# EAGLE design Scheda_motori_L298 (EAGLE 6.5.0)
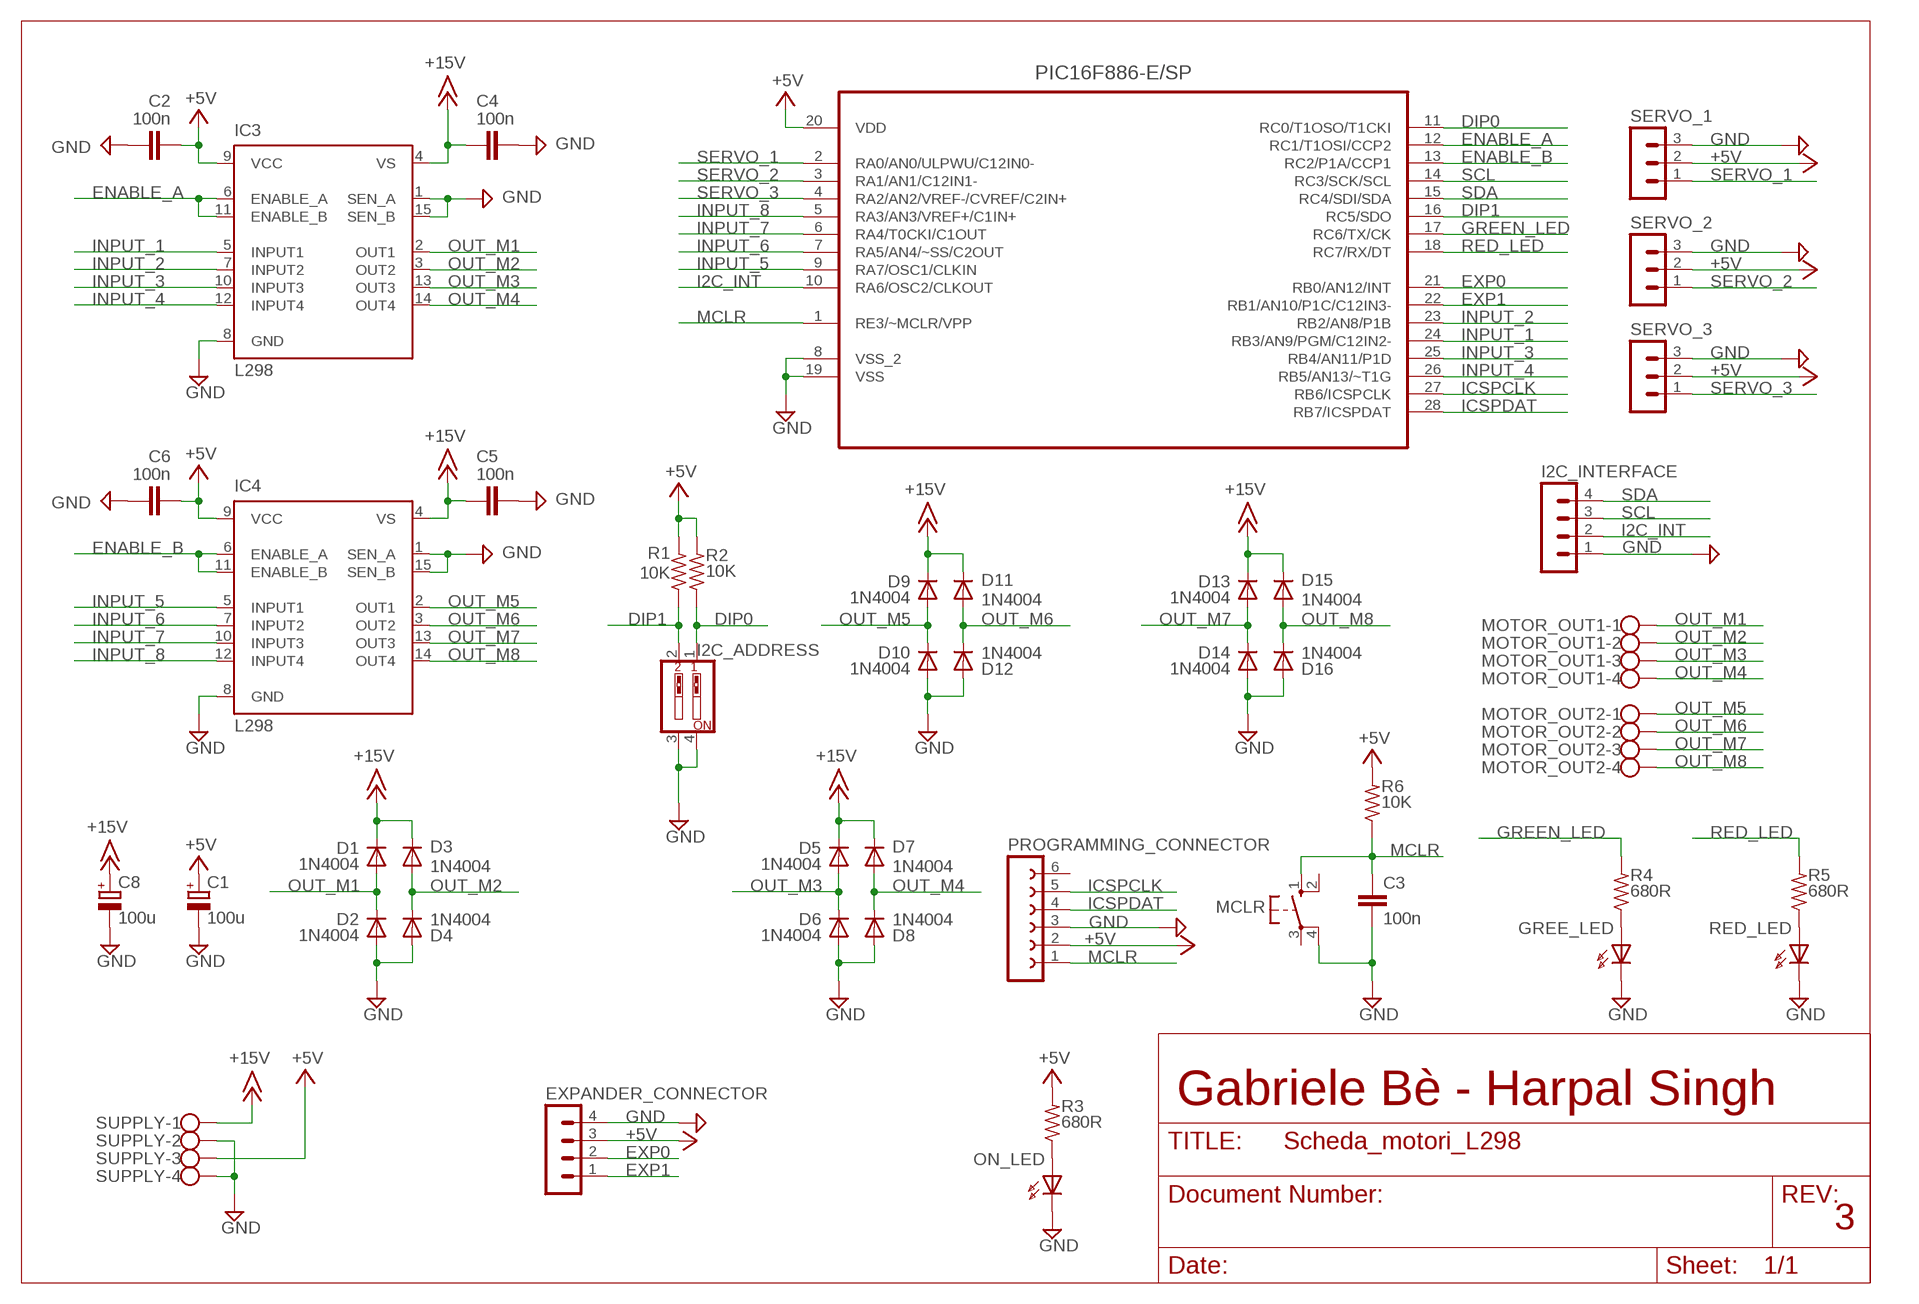
[diagram p0: schematic, sheet 1]

## Parts
C1  100u  CPOL-EUE2.5-7  [E2,5-7]
C2  100n  C-EU050-024X044  [C050-024X044]
C3  100n  C-EU050-024X044  [C050-024X044]
C4  100n  C-EU050-024X044  [C050-024X044]
C5  100n  C-EU050-024X044  [C050-024X044]
C6  100n  C-EU050-024X044  [C050-024X044]
C8  100u  CPOL-EUE2.5-7  [E2,5-7]
D1  1N4004  [DO41-10]
D2  1N4004  [DO41-10]
D3  1N4004  [DO41-10]
D4  1N4004  [DO41-10]
D5  1N4004  [DO41-10]
D6  1N4004  [DO41-10]
D7  1N4004  [DO41-10]
D8  1N4004  [DO41-10]
D9  1N4004  [DO41-10]
D10  1N4004  [DO41-10]
D11  1N4004  [DO41-10]
D12  1N4004  [DO41-10]
D13  1N4004  [DO41-10]
D14  1N4004  [DO41-10]
D15  1N4004  [DO41-10]
D16  1N4004  [DO41-10]
EXPANDER_CONNECTOR  MA04-1  [MA04-1]
GREE_LED  HLMP6  [HLMP6]
I2C_ADDRESS  SW_DIP-2  [EDG-02]
I2C_INTERFACE  MA04-1  [MA04-1]
IC3  L298  [MULTIWATT-15]
IC4  L298  [MULTIWATT-15]
MCLR  10-XX  [B3F-10XX]
MOTOR_OUT1  W237-4  [W237-4]
MOTOR_OUT2  W237-4  [W237-4]
ON_LED  HLMP6  [HLMP6]
PROGRAMMING_CONNECTOR  FE06-1  [FE06]
R1  10K  R-US_0207/10  [0207/10]
R2  10K  R-US_0207/10  [0207/10]
R3  680R  R-US_0207/10  [0207/10]
R4  680R  R-US_0207/10  [0207/10]
R5  680R  R-US_0207/10  [0207/10]
R6  10K  R-US_0207/10  [0207/10]
RED_LED  HLMP6  [HLMP6]
SERVO_1  MA03-1  [MA03-1]
SERVO_2  MA03-1  [MA03-1]
SERVO_3  MA03-1  [MA03-1]
SUPPLY  W237-4  [W237-4]
U$1  PIC16F886-E/SP  [DIP254P762X508-28]

## Nets
+5V: C1.+ C2.2 C6.2 EXPANDER_CONNECTOR.3 IC3.9(VCC) IC4.9(VCC) PROGRAMMING_CONNECTOR.2 R1.2 R2.2 R3.2 R6.2 SERVO_1.2 SERVO_2.2 SERVO_3.2 SUPPLY.3 U$1.20(VDD)
+15V: C4.1 C5.1 C8.+ D1.C D3.C D5.C D7.C D9.C D11.C D13.C D15.C IC3.4(VS) IC4.4(VS) SUPPLY.1
DIP0: I2C_ADDRESS.1 R2.1 U$1.11(RC0/T1OSO/T1CKI)
DIP1: I2C_ADDRESS.2 R1.1 U$1.16(RC5/SDO)
ENABLE_A: IC3.6(ENABLE_A) IC3.11(ENABLE_B) U$1.12(RC1/T1OSI/CCP2)
ENABLE_B: IC4.6(ENABLE_A) IC4.11(ENABLE_B) U$1.13(RC2/P1A/CCP1)
EXP0: EXPANDER_CONNECTOR.2 U$1.21(RB0/AN12/INT)
EXP1: EXPANDER_CONNECTOR.1 U$1.22(RB1/AN10/P1C/C12IN3-)
GND: C1.- C2.1 C3.2 C4.2 C5.2 C6.1 C8.- D2.A D4.A D6.A D8.A D10.A D12.A D14.A D16.A EXPANDER_CONNECTOR.4 GREE_LED.K I2C_ADDRESS.3 I2C_ADDRESS.4 I2C_INTERFACE.1 IC3.1(SEN_A) IC3.8(GND) IC3.15(SEN_B) IC4.1(SEN_A) IC4.8(GND) IC4.15(SEN_B) MCLR.4(P1) ON_LED.K PROGRAMMING_CONNECTOR.3 RED_LED.K SERVO_1.3 SERVO_2.3 SERVO_3.3 SUPPLY.2 SUPPLY.4 U$1.8(VSS_2) U$1.19(VSS)
GREEN_LED: R4.2 U$1.17(RC6/TX/CK)
I2C_INT: I2C_INTERFACE.2 U$1.10(RA6/OSC2/CLKOUT)
ICSPCLK: PROGRAMMING_CONNECTOR.5 U$1.27(RB6/ICSPCLK)
ICSPDAT: PROGRAMMING_CONNECTOR.4 U$1.28(RB7/ICSPDAT)
INPUT_1: IC3.5(INPUT1) U$1.24(RB3/AN9/PGM/C12IN2-)
INPUT_2: IC3.7(INPUT2) U$1.23(RB2/AN8/P1B)
INPUT_3: IC3.10(INPUT3) U$1.25(RB4/AN11/P1D)
INPUT_4: IC3.12(INPUT4) U$1.26(RB5/AN13/~T1G)
INPUT_5: IC4.5(INPUT1) U$1.9(RA7/OSC1/CLKIN)
INPUT_6: IC4.7(INPUT2) U$1.7(RA5/AN4/~SS/C2OUT)
INPUT_7: IC4.10(INPUT3) U$1.6(RA4/T0CKI/C1OUT)
INPUT_8: IC4.12(INPUT4) U$1.5(RA3/AN3/VREF+/C1IN+)
MCLR: C3.1 MCLR.1(S) PROGRAMMING_CONNECTOR.1 R6.1 U$1.1(RE3/~MCLR/VPP)
N$3: ON_LED.A R3.1
N$4: GREE_LED.A R4.1
N$5: R5.1 RED_LED.A
OUT_M1: D1.A D2.C IC3.2(OUT1) MOTOR_OUT1.1
OUT_M2: D3.A D4.C IC3.3(OUT2) MOTOR_OUT1.2
OUT_M3: D5.A D6.C IC3.13(OUT3) MOTOR_OUT1.3
OUT_M4: D7.A D8.C IC3.14(OUT4) MOTOR_OUT1.4
OUT_M5: D9.A D10.C IC4.2(OUT1) MOTOR_OUT2.1
OUT_M6: D11.A D12.C IC4.3(OUT2) MOTOR_OUT2.2
OUT_M7: D13.A D14.C IC4.13(OUT3) MOTOR_OUT2.3
OUT_M8: D15.A D16.C IC4.14(OUT4) MOTOR_OUT2.4
RED_LED: R5.2 U$1.18(RC7/RX/DT)
SCL: I2C_INTERFACE.3 U$1.14(RC3/SCK/SCL)
SDA: I2C_INTERFACE.4 U$1.15(RC4/SDI/SDA)
SERVO_1: SERVO_1.1 U$1.2(RA0/AN0/ULPWU/C12IN0-)
SERVO_2: SERVO_2.1 U$1.3(RA1/AN1/C12IN1-)
SERVO_3: SERVO_3.1 U$1.4(RA2/AN2/VREF-/CVREF/C2IN+)
Unconnected: MCLR.2(S1) MCLR.3(P) PROGRAMMING_CONNECTOR.6

## Notes on the sheet
- Gabriele Bè - Harpal Singh
- 3

## Library data of the parts
C1 C8 = ITIS:CPOL-EU: POLARIZED CAPACITOR, European symbol
C2-C6 = rcl:C-EU: CAPACITOR, European symbol
D1-D16 = ITIS:1N4004: DIODE general purpose rectifier, 1 A
EXPANDER_CONNECTOR I2C_INTERFACE = con-lstb:MA04-1: PIN HEADER; OC_FARNELL: unknown; OC_NEWARK: unknown
GREE_LED ON_LED RED_LED = display-hp:HLMP6: LED 2mm horizontal; MF: AGILENT TECHNOLOGIES; MPN: HLMP-6500; OC_FARNELL: 1652490; OC_NEWARK: 40K0088
I2C_ADDRESS = special:SW_DIP-2: DIP SWITCH
IC3 IC4 = st-microelectronics:L298: DUAL FULL-BRIDGE DRIVER
MCLR = ITIS:10-XX: OMRON SWITCH
MOTOR_OUT1 MOTOR_OUT2 SUPPLY = con-wago-500:W237-4: WAGO SCREW CLAMP; OC_FARNELL: unknown; OC_NEWARK: unknown
PROGRAMMING_CONNECTOR = con-lsta:FE06-1: FEMALE HEADER; OC_FARNELL: unknown; OC_NEWARK: unknown
R1-R6 = resistor:R-US_: RESISTOR, American symbol
SERVO_1-SERVO_3 = con-lstb:MA03-1: PIN HEADER; OC_FARNELL: unknown; OC_NEWARK: unknown
U$1 = Microchip_By_element14_Batch_1:PIC16F886-E/SP: 8-Bit CMOS Microcontrollers; MPN: PIC16F886-E/SP; OC_FARNELL: 1579590; OC_NEWARK: 74K8573; PACKAGE: DIP-28; SUPPLIER: Microchip

## Board
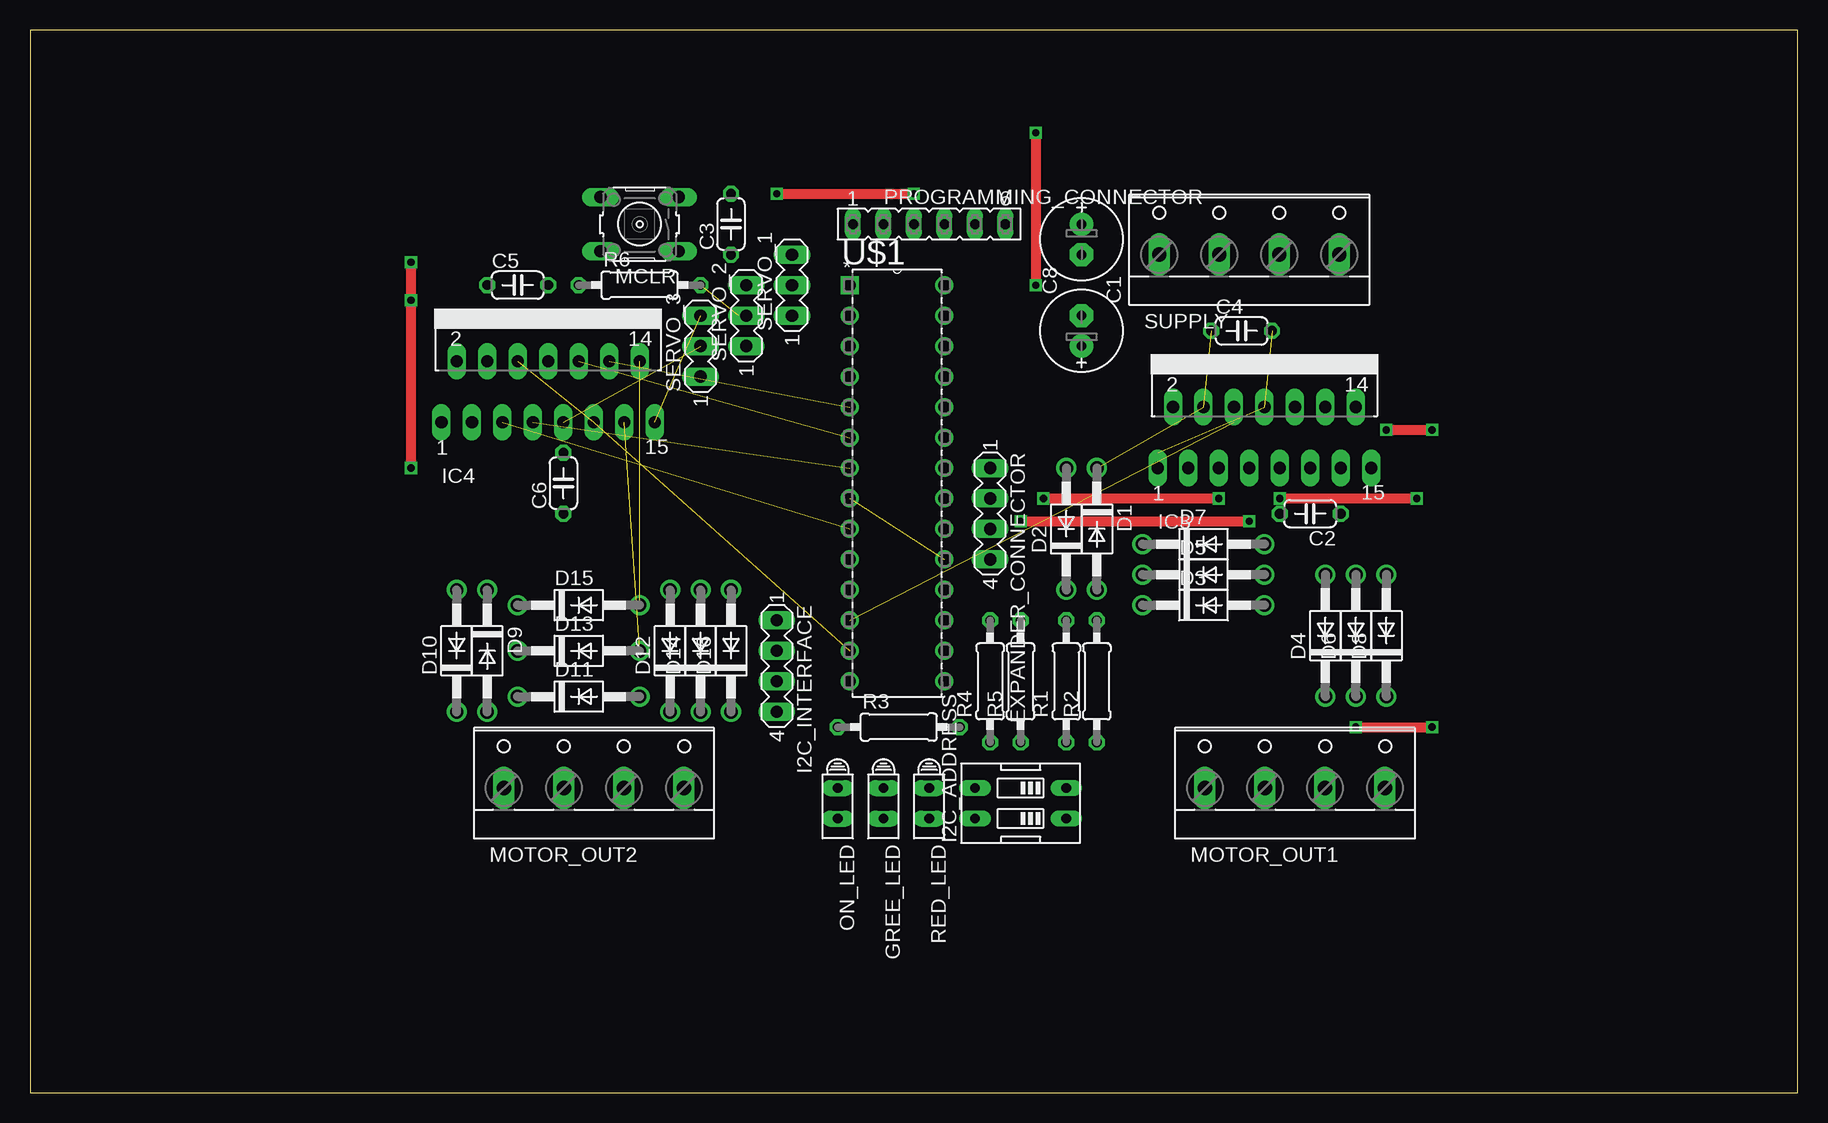
[diagram p1: board, top side]
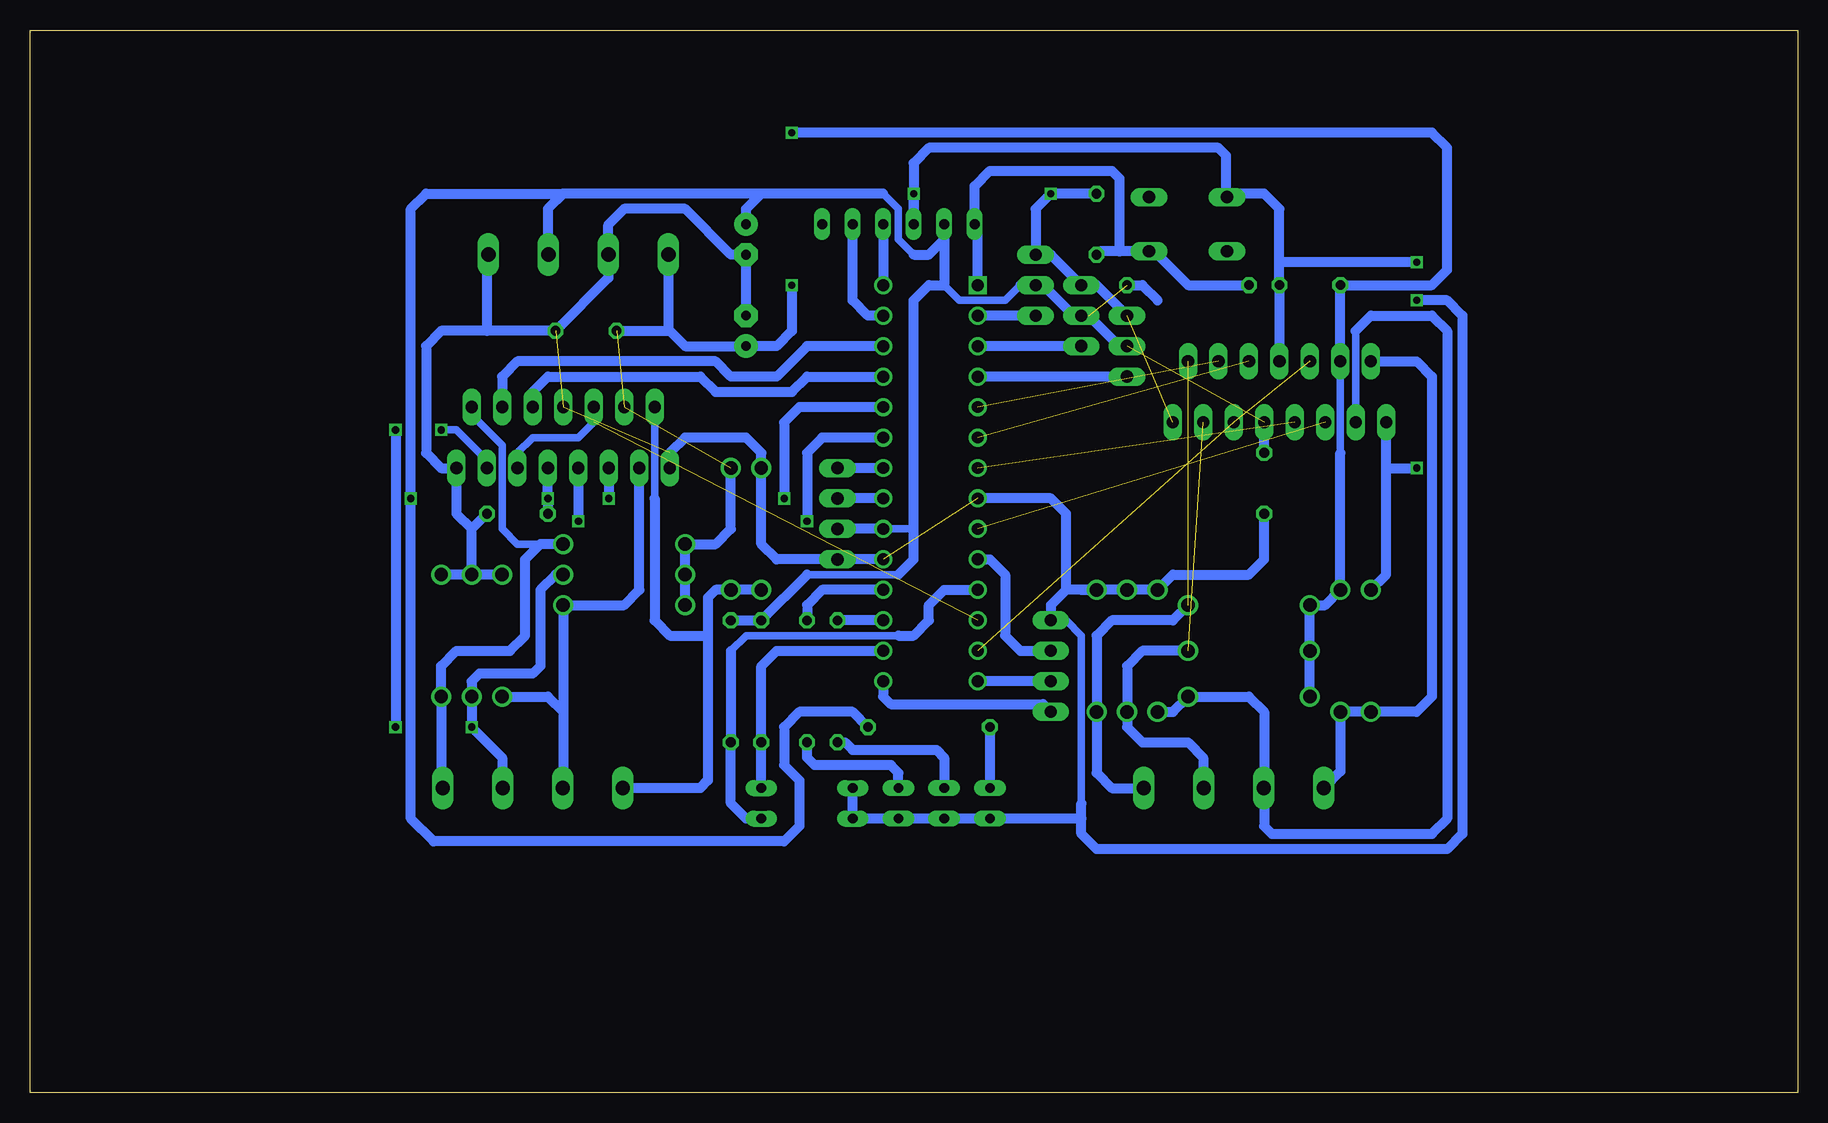
[diagram p2: board, bottom side, seen from below]

Size 147.3 x 88.57 mm. Coordinates in mm from the lower left corner, seen from the top.
Outline: 0,0 147.3,0 147.3,88.57 0,88.57 0,0
Copper layers (1*16): Top 0.035mm / dielectric 1.5mm / Bottom 0.035mm
Design rules "default": minimum track width 10mil, minimum drill 24mil, track to track 8mil, track to pad 8mil, pad to pad 8mil, via to via 8mil, smd to smd 8mil, copper to edge 40mil, drill to drill 8mil, minimum pad ring 10mil, minimum via ring 8mil, stop-mask expansion 4mil, vias tented up to drill 0mil, thermal gap 10mil

### Footprints (pad centres in the part's own frame; a part is rotated, then mirrored left to right if it is on the bottom)
E2,5-7 = drill 0.813 pad 1.93: + -1.27,0 | drill 0.813 pad 1.93 octagon: - 1.27,0
C050-024X044 = drill 0.813 octagon: 1 -2.54,0; 2 2.54,0
DO41-10 = drill 1.118: A 5.08,0; C -5.08,0
MA04-1 = drill 1.016 long: 1 -3.81,0; 2 -1.27,0; 3 1.27,0; 4 3.81,0
HLMP6 = drill 0.813 long: A -1.27,0; K 1.27,0
EDG-02 = drill 0.813 long: 1 -1.27,-3.81; 2 1.27,-3.81; 3 1.27,3.81; 4 -1.27,3.81
MULTIWATT-15 = drill 1.016 long: 1 -8.89,-7.62; 2 -7.62,-2.54; 3 -6.35,-7.62; 4 -5.08,-2.54; 5 -3.81,-7.62; 6 -2.54,-2.54; 7 -1.27,-7.62; 8 0,-2.54; 9 1.27,-7.62; 10 2.54,-2.54; 11 3.81,-7.62; 12 5.08,-2.54; 13 6.35,-7.62; 14 7.62,-2.54; 15 8.89,-7.62
B3F-10XX = drill 1.016 long: 1 -3.251,2.261; 2 3.251,2.261; 3 -3.251,-2.261; 4 3.251,-2.261
W237-4 = drill 1.194 long: 1 -7.5,-1.27; 2 -2.5,-1.27; 3 2.5,-1.27; 4 7.5,-1.27
FE06 = drill 0.813 long: 1 -6.35,0; 2 -3.81,0; 3 -1.27,0; 4 1.27,0; 5 3.81,0; 6 6.35,0
0207/10 = drill 0.813 octagon: 1 -5.08,0; 2 5.08,0
MA03-1 = drill 1.016 long: 1 -2.54,0; 2 0,0; 3 2.54,0
DIP254P762X508-28 = drill 0.991 square: 1 -7.874,33.02 | drill 0.991: 2 -7.874,30.48; 3 -7.874,27.94; 4 -7.874,25.4; 5 -7.874,22.86; 6 -7.874,20.32; 7 -7.874,17.78; 8 -7.874,15.24; 9 -7.874,12.7; 10 -7.874,10.16; 11 -7.874,7.62; 12 -7.874,5.08; 13 -7.874,2.54; 14 -7.874,0; 15 0,0; 16 0,2.54; 17 0,5.08; 18 0,7.62; 19 0,10.16; 20 0,12.7; 21 0,15.24; 22 0,17.78; 23 0,20.32; 24 0,22.86; 25 0,25.4; 26 0,27.94; 27 0,30.48; 28 0,33.02

### Placement (x,y rotation side)
C1  87.63,71.12 270 top
C2  106.68,48.26 180 top
C3  58.42,72.39 90 top
C4  100.97,63.5 0 top
C5  40.64,67.31 0 top
C6  44.45,50.8 90 top
C8  87.63,63.5 90 top
D1  88.9,46.99 270 top
D2  86.36,46.99 90 top
D3  97.79,40.64 0 top
D4  107.95,38.1 90 top
D5  97.79,43.18 0 top
D6  110.49,38.1 90 top
D7  97.79,45.72 0 top
D8  113.03,38.1 90 top
D9  38.1,36.83 270 top
D10  35.56,36.83 90 top
D11  45.72,33.02 0 top
D12  53.34,36.83 90 top
D13  45.72,36.83 0 top
D14  55.88,36.83 90 top
D15  45.72,40.64 0 top
D16  58.42,36.83 90 top
EXPANDER_CONNECTOR  80.01,48.26 270 top
GREE_LED  71.12,24.13 270 top
I2C_ADDRESS  82.55,24.13 90 top
I2C_INTERFACE  62.23,35.56 270 top
IC3  102.87,59.69 0 top
IC4  43.18,63.5 0 top
MCLR  50.8,72.39 180 top
MOTOR_OUT1  105.41,26.67 0 top
MOTOR_OUT2  46.99,26.67 0 top
ON_LED  67.31,24.13 270 top
PROGRAMMING_CONNECTOR  74.93,72.39 0 top
R1  86.36,34.29 90 top
R2  88.9,34.29 90 top
R3  72.39,30.48 0 top
R4  80.01,34.29 90 top
R5  82.55,34.29 90 top
R6  50.8,67.31 0 top
RED_LED  74.93,24.13 270 top
SERVO_1  63.5,67.31 90 top
SERVO_2  59.69,64.77 90 top
SERVO_3  55.88,62.23 90 top
SUPPLY  101.6,71.12 0 top
U$1  76.2,34.29 0 top

### Tracks (layer width: path | path; a pad name or v marks a point on that pad's centre or on a via)
+5V  (via drill 0.6)  (2 unrouted)
  Top 0.813: v104.14,49.53 v115.57,49.53
  Bottom 0.61: 73.66,69.85 74.93,71.12 74.93,73.66 76.2,74.93 | 71.12,67.31 69.85,66.04 66.04,66.04 64.77,67.31 | EXPANDER_CONNECTOR.3 73.66,46.99 | 82.55,43.18 74.93,43.18
  Bottom 0.813: C6.2 IC4.9 | 64.77,67.31 SERVO_1.2 62.86,67.31 60.32,64.77 SERVO_2.2 59.05,64.77 56.52,62.23 SERVO_3.2 | PROGRAMMING_CONNECTOR.2 71.12,71.12 | 76.2,74.93 86.36,74.93 | C1.+ 87.63,73.66 86.36,74.93 | 86.36,74.93 102.87,74.93 | 102.87,74.93 104.14,73.66 104.14,69.89 SUPPLY.3 | 73.66,69.85 72.39,69.85 71.12,71.12 | 71.12,71.12 71.12,67.31 72.39,67.31 73.66,66.04 73.66,46.99 73.66,44.45 74.93,43.18 | R2.2 R1.2 82.55,43.18 | U$1.20 EXPANDER_CONNECTOR.3 | R3.2 78.74,31.75 83.19,31.75 84.45,30.48 84.45,27.3 83.19,26.04 83.19,22.23 84.45,20.96 113.66,20.96 115.57,22.86 v115.57,49.53 115.57,73.66 114.3,74.93 102.87,74.93 | IC3.9 v104.14,49.53 C2.2 | R6.2 54.61,67.31 53.34,66.04
+15V  (via drill 0.6)  (2 unrouted)
  Top 0.813: v83.82,80.01 v83.82,67.31
  Bottom 0.61: 38.1,53.34 IC4.4
  Bottom 0.813: D11.C D13.C D15.C 39.37,40.64 D9.C 38.1,53.34 | D3.C D5.C D7.C 90.17,45.72 88.9,46.99 D1.C | SUPPLY.1 94.1,63.62 | 94.1,63.62 92.71,62.23 C8.+ 85.09,62.23 83.82,63.5 v83.82,67.31 | C4.1 94.22,63.5 94.1,63.62 | IC4.4 C5.1 30.48,67.31 29.21,68.58 29.21,78.74 30.48,80.01 v83.82,80.01
DIP0
  Bottom 0.61: 88.9,36.83 87.63,38.1 74.93,38.1
  Bottom 0.813: I2C_ADDRESS.1 87.63,22.86 88.9,24.13 R2.1 88.9,36.83 | 74.93,38.1 73.66,38.1 72.39,39.37 72.39,40.64 71.12,41.91 U$1.11
DIP1
  Bottom 0.813: I2C_ADDRESS.2 R1.1 86.36,35.56 85.09,36.83 U$1.16
ENABLE_A  (1 unrouted)
  Bottom 0.61: IC3.6 100.33,55.88 101.6,54.61 105.41,54.61 106.68,53.34 IC3.11
ENABLE_B  (2 unrouted)
EXP0
  Bottom 0.813: U$1.21 EXPANDER_CONNECTOR.2
EXP1
  Bottom 0.813: U$1.22 EXPANDER_CONNECTOR.1
GND  (via drill 0.6)  (4 unrouted)
  Top 0.813: v62.23,74.93 v73.66,74.93 | v31.75,52.07 v31.75,66.04 v31.75,69.22
  Bottom 0.61: I2C_INTERFACE.1 60.96,39.37 59.69,38.1 59.69,24.13
  Bottom 0.813: D16.A D14.A D12.A 52.07,43.18 45.72,43.18 44.45,44.45 C6.1 | 59.69,41.91 D16.A | D16.A 60.96,41.91 | 60.96,41.91 62.23,40.64 I2C_INTERFACE.1 | I2C_ADDRESS.3 I2C_ADDRESS.4 RED_LED.K GREE_LED.K ON_LED.K 59.69,22.86 | IC4.8 C5.2 43.18,69.22 | 46.99,74.93 47.27,74.93 MCLR.4 | C3.2 v62.23,74.93 63.5,73.66 SERVO_1.3 62.23,69.85 SERVO_2.3 58.42,67.31 SERVO_3.3 | C8.- C1.- 88.9,69.85 92.71,73.66 97.79,73.66 99.1,72.35 SUPPLY.2 99.1,67.91 C4.2 109.22,63.5 | v73.66,74.93 PROGRAMMING_CONNECTOR.3 73.66,77.47 72.39,78.74 48.26,78.74 47.62,78.11 47.62,74.3 46.99,74.93 | D4.A D6.A | D6.A D8.A | D6.A 110.49,46.99 | 110.49,46.99 C2.1 | 110.49,46.99 111.76,48.26 IC3.15 113.03,52.07 114.3,53.34 114.3,62.23 113.03,63.5 109.22,63.5 | U$1.19 EXPANDER_CONNECTOR.4 85.09,44.45 86.36,45.72 D2.A 86.36,53.34 87.63,54.61 92.71,54.61 93.98,53.34 IC3.1 | SUPPLY.4 109.22,69.73 109.22,63.5 | 60.96,41.91 60.96,48.26 62.23,49.53 U$1.8 | v31.75,69.22 43.18,69.22 | 43.18,69.22 43.18,73.66 44.45,74.93 46.99,74.93 | 34.29,52.07 IC4.1 | 59.69,22.86 59.69,21.59 58.42,20.32 29.21,20.32 27.94,21.59 27.94,64.77 29.21,66.04 v31.75,66.04 | 59.69,22.86 59.69,24.13 | D10.A 34.29,43.18 34.29,52.07 | 34.29,52.07 v31.75,52.07
GREEN_LED
  Bottom 0.813: U$1.17 R4.2
I2C_INT
  Bottom 0.813: U$1.10 67.31,44.45 66.04,43.18 66.04,38.1 64.77,36.83 I2C_INTERFACE.2
ICSPCLK
  Bottom 0.813: U$1.27 77.47,64.77 78.74,66.04 PROGRAMMING_CONNECTOR.5
ICSPDAT
  Bottom 0.813: PROGRAMMING_CONNECTOR.4 U$1.28
INPUT_1  (via drill 0.6)
  Top 0.813: v84.45,49.53 v99.06,49.53
  Bottom 0.813: IC3.5 v99.06,49.53 | U$1.24 83.19,57.15 84.45,55.88 v84.45,49.53
INPUT_2  (via drill 0.6)
  Top 0.813: v82.55,47.62 v101.6,47.62
  Bottom 0.813: U$1.23 81.28,54.61 82.55,53.34 v82.55,47.62 | IC3.7 v101.6,47.62
INPUT_3
  Bottom 0.813: IC3.10 105.41,58.42 104.14,59.69 91.44,59.69 90.17,58.42 83.82,58.42 82.55,59.69 U$1.25
INPUT_4
  Bottom 0.813: U$1.26 82.55,62.23 85.09,59.69 88.9,59.69 90.17,60.96 106.68,60.96 107.95,59.69 IC3.12
INPUT_5  (1 unrouted)
INPUT_6  (1 unrouted)
INPUT_7  (1 unrouted)
INPUT_8  (1 unrouted)
MCLR
  Bottom 0.813: R6.1 50.8,67.31 53.62,70.13 MCLR.1 56.52,70.13 | 56.52,70.13 58.14,70.13 C3.1 | 56.52,70.13 56.52,76.2 57.15,76.84 67.31,76.84 68.58,75.56 PROGRAMMING_CONNECTOR.1 68.33,72.14 U$1.1
N$1  (via drill 0.6)
  other vias: 116.84,55.24
N$2  (via drill 0.6)
  other vias: 83.82,67.31
N$3
  Bottom 0.813: R3.1 ON_LED.A
N$4
  Bottom 0.813: R4.1 79.38,29.21 78.74,28.57 71.75,28.57 71.12,27.94 GREE_LED.A
N$5
  Bottom 0.813: RED_LED.A 74.93,26.67 75.56,27.3 81.91,27.3 82.55,27.94 R5.1
OUT_M1
  Bottom 0.61: IC3.2 95.25,49.53
  Bottom 0.813: D2.C D1.A 90.17,41.91 90.8,41.27 90.8,38.1 | 90.8,38.1 90.8,26.04 91.44,25.4 MOTOR_OUT1.1 | 90.8,38.1 93.98,38.1 95.25,39.37 95.25,49.53
OUT_M2
  Bottom 0.813: D4.C 104.14,33.02 102.87,31.75 | 102.87,31.75 102.87,25.44 MOTOR_OUT1.2 | 102.87,31.75 D3.A 97.79,40.64 96.52,41.91 IC3.3
OUT_M3  (via drill 0.6)
  Top 0.813: v113.03,55.24 v116.84,55.24 | v110.49,30.48 v116.84,30.48
  Bottom 0.61: IC3.13 109.22,52.7 111.76,55.24 v113.03,55.24
  Bottom 0.813: MOTOR_OUT1.3 107.95,25.44 107.95,27.94 v110.49,30.48 D6.C 110.49,34.29 109.86,34.92 105.41,34.92 104.77,35.56 104.77,41.91 103.5,43.18 D5.A | v116.84,55.24 v116.84,30.48
OUT_M4
  Bottom 0.61: 104.77,45.72 106.68,45.72 107.95,46.99 107.95,53.97 110.49,56.51 IC3.14
  Bottom 0.813: MOTOR_OUT1.4 113.03,25.4 D8.C 113.03,35.56 111.76,36.83 107.31,36.83 106.05,38.1 106.05,44.45 104.77,45.72 D7.A
OUT_M5
  Bottom 0.813: MOTOR_OUT2.1 38.1,26.79 D9.A D10.C 31.75,31.75 30.48,33.02 30.48,59.69 31.75,60.96 IC4.2
OUT_M6
  Bottom 0.61: 36.83,63.5 IC4.3
  Bottom 0.813: 44.45,25.44 44.45,31.75 45.72,33.02 D11.A 52.07,31.75 D12.C | 44.45,25.44 MOTOR_OUT2.2 | 44.45,25.44 44.45,22.23 43.81,21.59 30.48,21.59 29.21,22.86 29.21,63.5 30.48,64.77 35.56,64.77 36.83,63.5
OUT_M7  (1 unrouted)
  Bottom 0.813: D13.A 54.61,36.83 55.88,35.56 D14.C 55.88,30.48 54.61,29.21 50.8,29.21 49.53,27.94 49.53,25.44 MOTOR_OUT2.3
OUT_M8  (1 unrouted)
  Bottom 0.813: D15.A 52.07,39.37 57.15,39.37 58.42,38.1 D16.C 58.42,26.67 57.15,25.4 MOTOR_OUT2.4
RED_LED
  Bottom 0.813: U$1.18 81.28,41.91 82.55,40.64 R5.2
SCL
  Bottom 0.813: I2C_INTERFACE.3 U$1.14
SDA
  Bottom 0.813: U$1.15 76.2,33.02 75.56,32.38 62.86,32.38 I2C_INTERFACE.4
SERVO_1
  Bottom 0.813: SERVO_1.1 U$1.2
SERVO_2
  Bottom 0.813: SERVO_2.1 U$1.3
SERVO_3
  Bottom 0.813: SERVO_3.1 U$1.4